# Altium project Load_Bank_Switch_New.PrjPcb
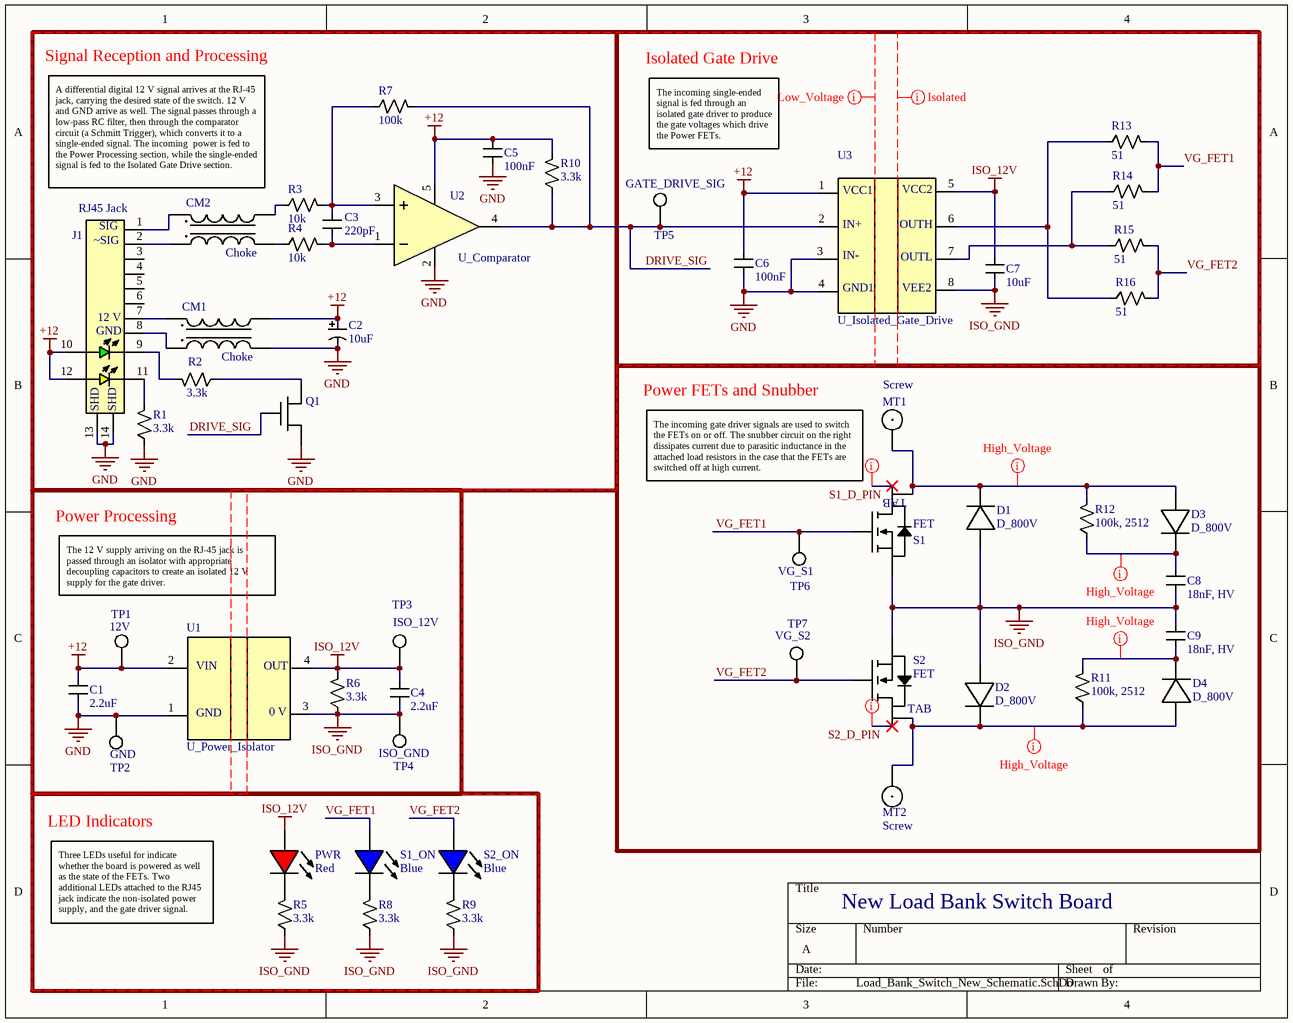
[diagram p0: Load_Bank_Switch_New_Schematic.SchDoc]
1 sheet, 50 parts. Net scope: global (net labels, ports and power ports of the same name join across sheets).
Board file: Load_Bank_Switch_New_PCB.PcbDoc

## Sheet Load_Bank_Switch_New_Schematic.SchDoc
size A; SheetNumber: 1; SheetTotal: 1

### Parts
12V  TP1  [0603_TP]
C1  2.2uF  [0603_CAP]
C2  10uF  [ALUM_CAP]
C3  220pF  [0603_CAP]
C4  2.2uF  [0603_CAP]
C5  100nF  [0603_CAP]
C6  100nF  [0603_CAP]
C7  10uF  [0805_CAP]
C8  18nF, HV  [1210_CAP]
C9  18nF, HV  [1210_CAP]
CM1  Choke  [CHOKE]
CM2  Choke  [CHOKE]
D1  D_800V  [DIODE]
D2  D_800V  [DIODE]
D3  D_800V  [DIODE]
D4  D_800V  [DIODE]
GATE_DRIVE_SIG  TP5  [0603_TP]
GND  TP2  [0603_TP]
ISO_12V  TP3  [0603_TP]
ISO_GND  TP4  [0603_TP]
J1  RJ45 Jack  [RJ45_JACK]
MT1  Screw  [MOUNT]
MT2  Screw  [MOUNT]
PWR  Red  [0603_LED]
Q1  Logic FET  [SOT23]  (value not drawn)
R1  3.3k  [0603_RES]
R2  3.3k  [0603_RES]
R3  10k  [0603_RES]
R4  10k  [0603_RES]
R5  3.3k  [0603_RES]
R6  3.3k  [0603_RES]
R7  100k  [0603_RES]
R8  3.3k  [0603_RES]
R9  3.3k  [0603_RES]
R10  3.3k  [0603_RES]
R11  100k, 2512  [2512_RES]
R12  100k, 2512  [2512_RES]
R13  51  [0603_RES]
R14  51  [0603_RES]
R15  51  [0603_RES]
R16  51  [0603_RES]
S1  FET  [FET]
S1_ON  Blue  [0603_LED]
S2  FET  [FET]
S2_ON  Blue  [0603_LED]
U1  U_Power_Isolator  [PWR_ISOLATOR]
U2  U_Comparator  [COMPARATOR]
U3  U_Isolated_Gate_Drive  [GATE_DRIVER]
VG_S1  TP6  [0603_TP]
VG_S2  TP7  [0603_TP]

### Blocks framed on the sheet
Signal Reception and Processing: C2 C3 C5 CM1 CM2 J1 Q1 R1-R4 R7 R10 U2
Isolated Gate Drive: C6 C7 GATE_DRIVE_SIG R13-R16 U3
Power FETs and Snubber: C8 C9 D1-D4 MT1 MT2 R11 R12 S1 S2 VG_S1 VG_S2
Power Processing: 12V C1 C4 GND ISO_12V ISO_GND R6 U1
LED Indicators: PWR R5 R8 R9 S1_ON S2_ON

### Nets
+12: 12V.1(Sig) C1.2 C2.2 C5.2 C6.2 CM1.2(Out1) J1.10 J1.12 R10.2 U1.2(Vin) U2.5(VDD) U3.1(VCC1)
GND: C1.1 C2.1 C5.1 C6.1 CM1.3(Out2) GND.1(Sig) J1.13(SHD1) J1.14(SHD2) Q1.3(S) R1.1 U1.1(GND) U2.2(GND) U3.3(IN-) U3.4(GND1)
ISO_12V: C4.2 C7.2 ISO_12V.1(Sig) PWR.2 R6.2 U1.4(Out) U3.5(VCC2)
ISO_GND: C4.1 C7.1 C8.1 C9.2 D1.2 D2.2 ISO_GND.1(Sig) R5.1 R6.1 R8.1 R9.1 S1.3(S) S2.3(S) U1.3(0V) U3.8(VEE2)
DRIVE_SIG: GATE_DRIVE_SIG.1(Sig) Q1.2(G) R7.2 R10.1 U2.4(Out) U3.2(IN+)
S1_D_PIN: S1.2(D)
S2_D_PIN: S2.2(D)
VG_FET1: R13.2 R14.2 S1.1(G) S1_ON.2 VG_S1.1(Sig)
VG_FET2: R15.2 R16.2 S2.1(G) S2_ON.2 VG_S2.1(Sig)
NetC3_1: C3.1 R4.2 U2.1(V-)
NetC3_2: C3.2 R3.2 R7.1 U2.3(V+)
NetC8_2: C8.2 D3.1 R12.1
NetC9_1: C9.1 D4.1 R11.2
NetCM1_1: CM1.1(In1) J1.7(12_V)
NetCM1_4: CM1.4(In2) J1.8(GND)
NetCM2_1: CM2.1(In1) J1.1(Sig1)
NetCM2_2: CM2.2(Out1) R3.1
NetCM2_3: CM2.3(Out2) R4.1
NetCM2_4: CM2.4(In2) J1.2(Sig2)
NetD1_1: D1.1 D3.2 MT1.1 R12.2 S1.4(TAB)
NetD2_1: D2.1 D4.2 MT2.1 R11.1 S2.4(TAB)
NetJ1_9: J1.9 R2.2
NetJ1_11: J1.11 R1.2
NetPWR_1: PWR.1 R5.2
NetQ1_1: Q1.1(D) R2.1
NetR8_2: R8.2 S1_ON.1
NetR9_2: R9.2 S2_ON.1
NetR13_1: R13.1 R16.1 U3.6(OUTH)
NetR14_1: R14.1 R15.1 U3.7(OUTL)

Not connected (* = marked no-connect by the designer): J1 3(NC) 4(NC) 5(NC) 6(NC)

### Layout directives
net class High_Voltage: NetC8_2, NetC9_1, NetD1_1, NetD2_1, S1_D_PIN, S2_D_PIN
net class Low_Voltage: +12, DRIVE_SIG, GND
net class Isolated: ISO_12V, ISO_GND, VG_FET1, VG_FET2

### Notes on the sheet
- The incoming single-ended signal is fed through an isolated gate driver to produce the gate voltages which drive the Power FETs.
- A differential digital 12 V signal arrives at the RJ-45 jack, carrying the desired state of the switch. 12 V and GND arrive as well. The signal passes through a low-pass RC filter, then through the comparator circuit (a Schmitt Trigger), which converts it to a single-ended signal. The incoming  power is fed to the Power Processing section, while the single-ended signal is fed to the Isolated Gate Drive section.
- (near S1) The incoming gate driver signals are used to switch the FETs on or off. The snubber circuit on the right dissipates current due to parasitic inductance in the attached load resistors in the case that the FETs are switched off at high current.
- The 12 V supply arriving on the RJ-45 jack is passed through an isolator with appropriate decoupling capacitors to create an isolated 12 V supply for the gate driver.
- New Load Bank Switch Board
- Three LEDs useful for indicate whether the board is powered as well as the state of the FETs. Two additional LEDs attached to the RJ45 jack indicate the non-isolated power supply, and the gate driver signal.
- (in symbol J_RJ45_Jack) SIG; ~SIG; SHD
- (in symbol U_Power_Isolator) VIN; OUT; 0 V

### Library data of the parts
12V GATE_DRIVE_SIG GND ISO_12V ISO_GND VG_S1 VG_S2 = TP_TestPoint: Test Point 0603
C1 C4 = C_2.2uF_0603: Capacitor SMD MLCC 2.2 uF 0603
C2 = C_10uF_AlElec: Capacitor SMD Aluminum Electrolytic 10 uF
C3 = C_220pF_0603: Capacitor SMD MLCC 220 pF 0603 5%
C5 C6 = C_100nF_0603: Capacitor SMD MLCC 100 nF 0603
C7 = C_10uF_0805: Capacitor SMD MLCC 10 uF 0805
C8 C9 = C_18nF_1210_1kV: Capacitor SMD MLCC C0G 18 nF 1 kV 1210
CM1 CM2 = CM_Common_Mode_Choke: Common Mode Choke
D1-D4 = D_800V: Diode 800 V 8 A diode
J1 = J_RJ45_Jack: Jack RJ-45 8-pin
MT1 MT2 = MT_Screw: Screw Mount for connecting board to resistors
PWR = LED_0603_Red: LED SMD 0603 Red
Q1 = Q_NFET: N-Channel Logic FET SOT23-3
R1 R2 R5 R6 R8-R10 = R_3300Ohm_0603_1%: Resistor 3.3 kOhm 0603 1%
R3 R4 = R_10kOhm_0603_1%: Resistor 10 kOhm 0603 1%
R7 = R_100kOhm_0603_5%: Resistor 100 kOhm 0603 5%
R11 R12 = R_100kOhm_2512_5%: Resistor 100 kOhm 2512 5%
R13-R16 = R_51Ohm_0603_1%: Resistor 51 Ohm 0603 1%
S1 S2 = S_PowerFET: N-Channel Power FET 650 V 24 A
S1_ON S2_ON = LED_0603_Blue: LED SMD 0603 Blue
U1 = U_Power_Isolator: IC Power Isolator 12V-12V DC-DC Converter
U2 = U_Comparator: IC Comparator 36 V 300 ns Response Open-Collector
U3 = U_Isolated_Gate_Drive: IC Isolated Gate Drive 3-15 V Output Supply Split Output